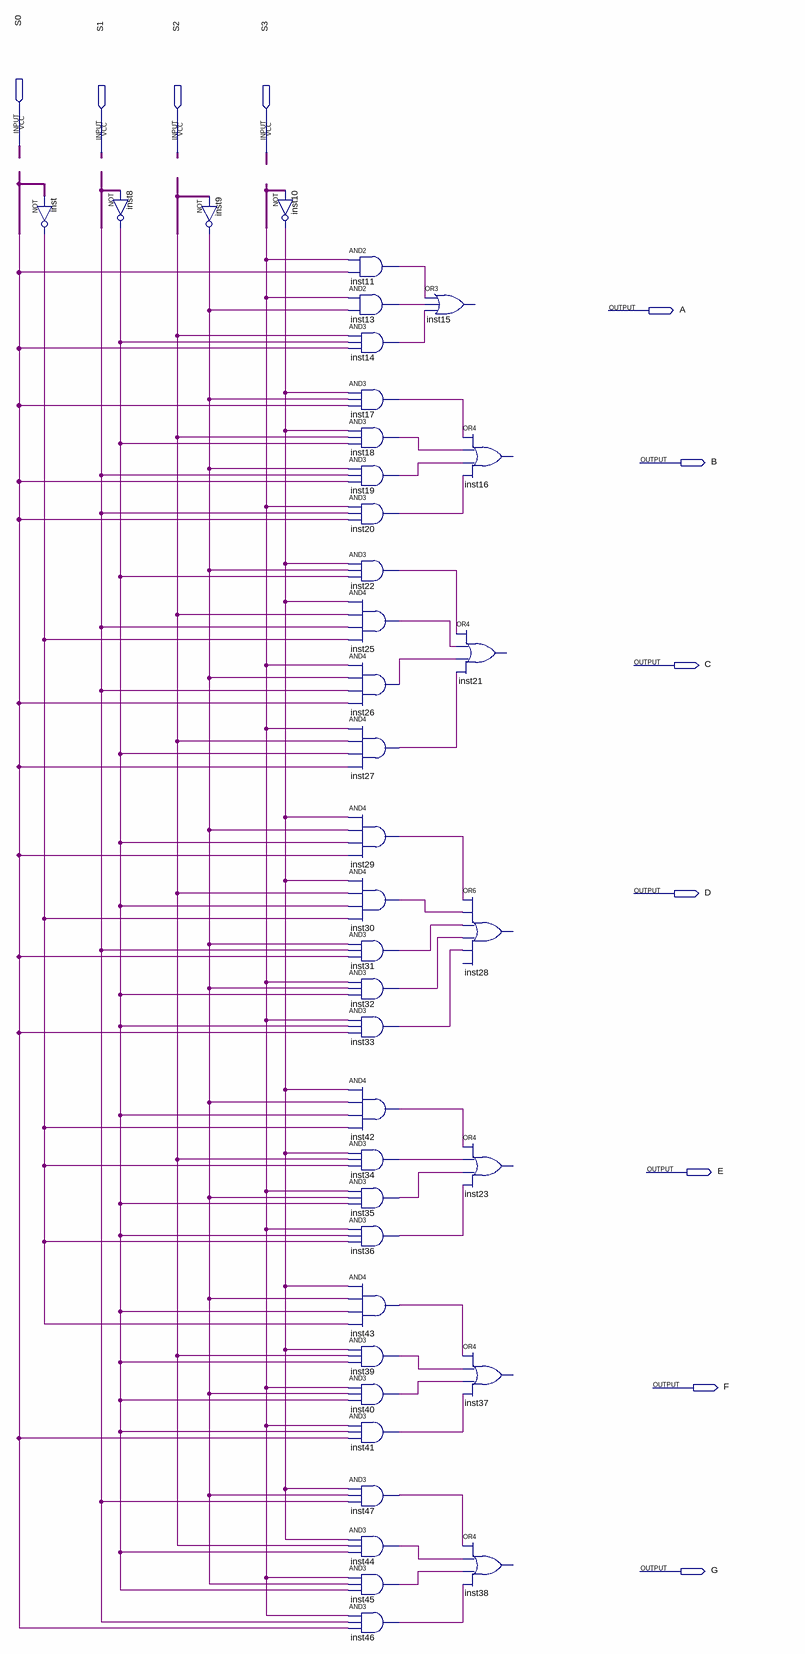
[diagram p0: schematic sheet]
// Quartus schematic BintoHex.bdf as structural Verilog: 39 symbols, 11 pins
module BintoHex (
  input  S0,
  input  S1,
  input  S2,
  input  S3,
  output A,
  output B,
  output C,
  output D,
  output E,
  output F,
  output G
);

  wire inst8_out, inst9_out, inst10_out, inst11_out, inst13_out, inst14_out, inst17_out, inst18_out,
       inst19_out, inst20_out, inst22_out, inst25_out, inst26_out, inst27_out, inst29_out, inst30_out,
       inst31_out, inst32_out, inst33_out, inst34_out, inst35_out, inst36_out, inst39_out, inst40_out,
       inst41_out, inst42_out, inst43_out, inst44_out, inst45_out, inst46_out, inst47_out, inst_out,
       undriven, undriven_2, undriven_3, undriven_4;

  not inst (inst_out, undriven_4);
  not inst8 (inst8_out, undriven_3);
  not inst9 (inst9_out, undriven);
  not inst10 (inst10_out, undriven_2);
  and inst11 (inst11_out, undriven_2, undriven_4);
  and inst13 (inst13_out, undriven_2, inst9_out);
  and inst14 (inst14_out, undriven, inst8_out, undriven_4);
  and inst17 (inst17_out, inst10_out, inst9_out, undriven_4);
  and inst18 (inst18_out, inst10_out, undriven, inst8_out);
  and inst19 (inst19_out, inst9_out, undriven_3, undriven_4);
  and inst20 (inst20_out, undriven_2, undriven_3, undriven_4);
  and inst22 (inst22_out, inst10_out, inst9_out, inst8_out);
  and inst25 (inst25_out, inst10_out, undriven, undriven_3, inst_out);
  and inst26 (inst26_out, undriven_2, inst9_out, undriven_3, undriven_4);
  and inst27 (inst27_out, undriven_2, undriven, inst8_out, undriven_4);
  and inst29 (inst29_out, inst10_out, inst9_out, inst8_out, undriven_4);
  and inst30 (inst30_out, inst10_out, undriven, inst8_out, inst_out);
  and inst31 (inst31_out, inst9_out, undriven_3, undriven_4);
  and inst32 (inst32_out, undriven_2, inst9_out, inst8_out);
  and inst33 (inst33_out, undriven_2, inst8_out, undriven_4);
  and inst42 (inst42_out, inst10_out, inst9_out, inst8_out, inst_out);
  and inst34 (inst34_out, inst10_out, undriven, inst_out);
  and inst35 (inst35_out, undriven_2, inst9_out, inst8_out);
  and inst36 (inst36_out, undriven_2, inst8_out, inst_out);
  and inst43 (inst43_out, inst10_out, inst9_out, inst8_out, inst_out);
  and inst39 (inst39_out, inst10_out, undriven, inst8_out);
  and inst40 (inst40_out, undriven_2, inst9_out, inst8_out);
  and inst41 (inst41_out, undriven_2, inst8_out, undriven_4);
  and inst47 (inst47_out, inst10_out, inst9_out, undriven_3);
  and inst44 (inst44_out, inst10_out, undriven, inst8_out);
  and inst45 (inst45_out, undriven_2, inst9_out, inst8_out);
  and inst46 (inst46_out, undriven_2, undriven_3, undriven_4);
  // OR3 inst15 has open pins: IN1=inst11_out, IN2=inst13_out, IN3=inst14_out, OUT=open
  // OR4 inst16 has open pins: IN1=inst17_out, IN2=inst18_out, IN3=inst19_out, IN4=inst20_out, OUT=open
  // OR4 inst21 has open pins: IN1=inst22_out, IN2=inst25_out, IN3=inst26_out, IN4=inst27_out, OUT=open
  // OR6 inst28 has open pins: IN1=inst29_out, IN2=inst30_out, IN3=inst31_out, IN4=inst32_out, IN5=inst33_out, IN6=open, OUT=open
  // OR4 inst23 has open pins: IN1=inst42_out, IN2=inst34_out, IN3=inst35_out, IN4=inst36_out, OUT=open
  // OR4 inst37 has open pins: IN1=inst43_out, IN2=inst39_out, IN3=inst40_out, IN4=inst41_out, OUT=open
  // OR4 inst38 has open pins: IN1=inst47_out, IN2=inst44_out, IN3=inst45_out, IN4=inst46_out, OUT=open
endmodule
